# EAGLE design Esquemático (EAGLE 9.6.2)
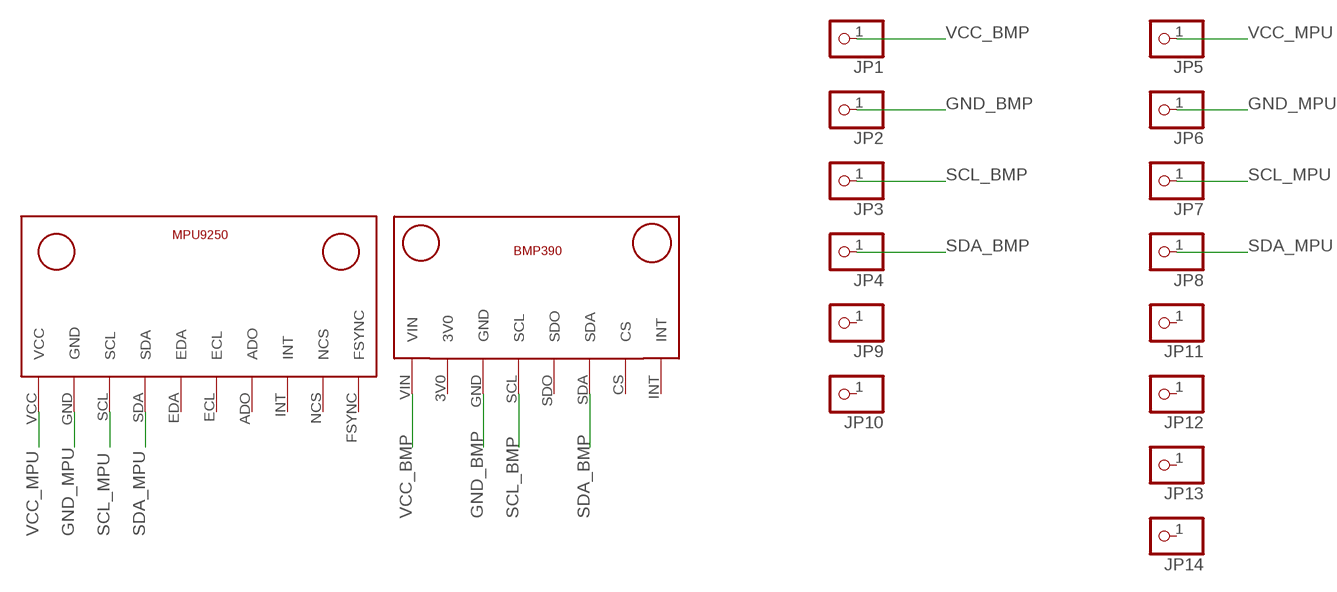
[diagram p0: schematic, sheet 1]

## Parts
JP1  PINHD-1X1  [1X01]
JP2  PINHD-1X1  [1X01]
JP3  PINHD-1X1  [1X01]
JP4  PINHD-1X1  [1X01]
JP5  PINHD-1X1  [1X01]
JP6  PINHD-1X1  [1X01]
JP7  PINHD-1X1  [1X01]
JP8  PINHD-1X1  [1X01]
JP9  PINHD-1X1  [1X01]
JP10  PINHD-1X1  [1X01]
JP11  PINHD-1X1  [1X01]
JP12  PINHD-1X1  [1X01]
JP13  PINHD-1X1  [1X01]
JP14  PINHD-1X1  [1X01]
U$3  BMP390V1  [BMP390_FOOTPRINT]
U$4  MPU9250V1  [MPU9250_FOOTPRINT]

## Nets
GND_BMP: JP2.1 U$3.GND
GND_MPU: JP6.1 U$4.GND
SCL_BMP: JP3.1 U$3.SCL
SCL_MPU: JP7.1 U$4.SCL
SDA_BMP: JP4.1 U$3.SDA
SDA_MPU: JP8.1 U$4.SDA
VCC_BMP: JP1.1 U$3.VIN
VCC_MPU: JP5.1 U$4.VCC
Unconnected: JP9.1 JP10.1 JP11.1 JP12.1 JP13.1 JP14.1 U$3.3V0 U$3.CS U$3.INT U$3.SDO U$4.ADO U$4.ECL U$4.EDA U$4.FSYNC U$4.INT U$4.NCS

## Library data of the parts
JP1-JP14 = pinhead:PINHD-1X1: PIN HEADER
U$3 = CRD:BMP390: Sensor barométrico
U$4 = CRD:MPU9250: Acelerômetro e Giroscópio

## Board
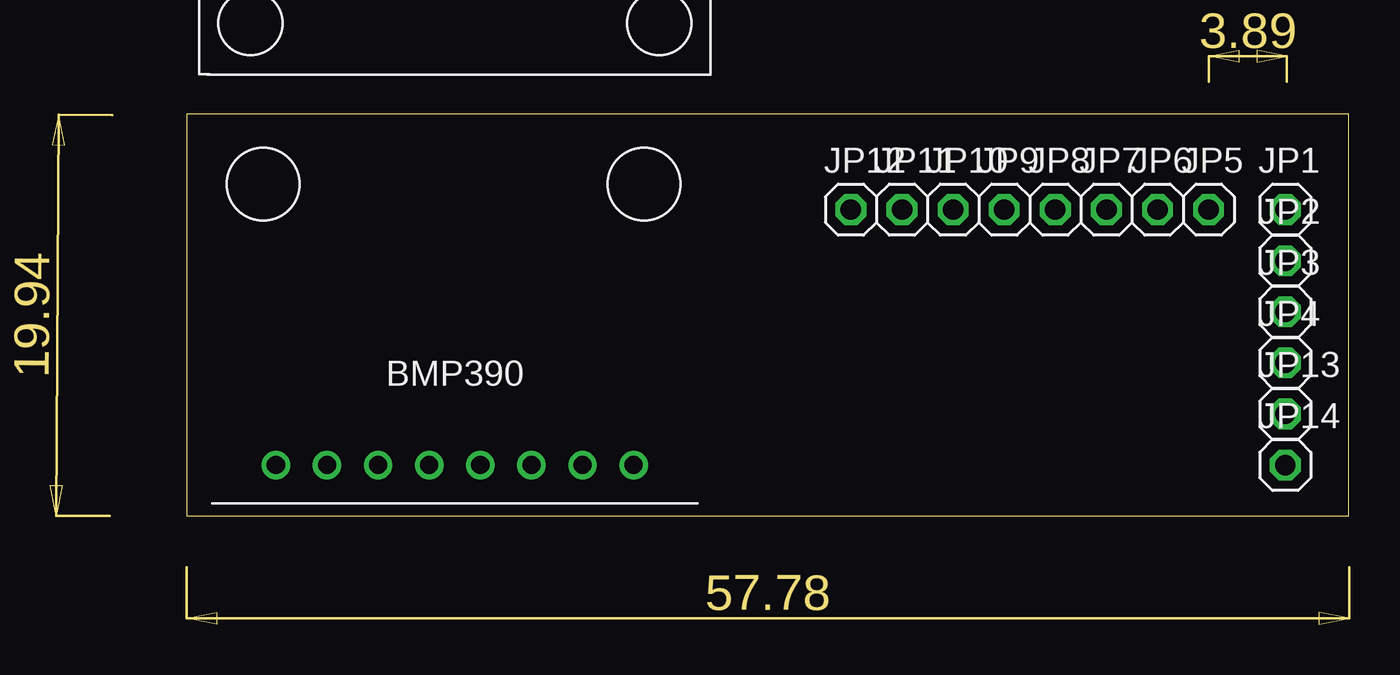
[diagram p1: board, top side]
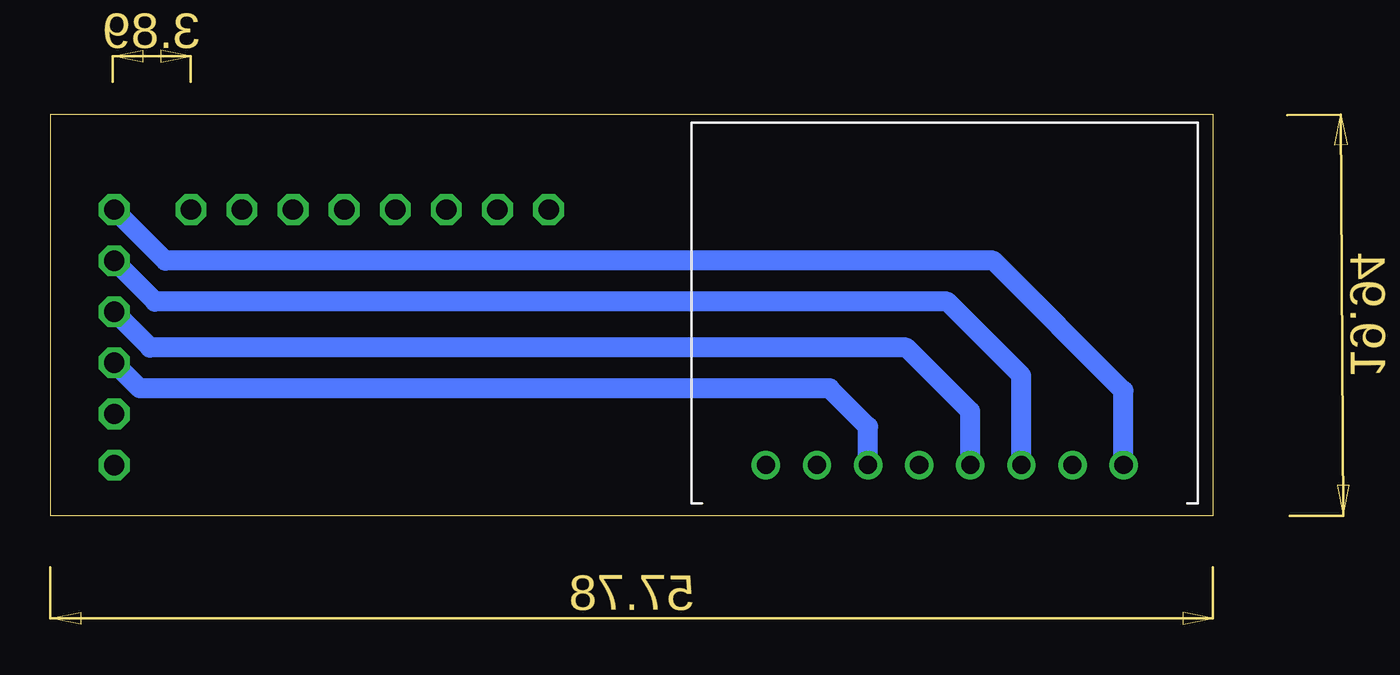
[diagram p2: board, bottom side, seen from below]

Size 57.77 x 19.99 mm. Coordinates in mm from the lower left corner, seen from the top.
Outline: 0,0 57.77,0 57.77,19.99 0,19.99 0,0
Copper layers (1*16): Top 0.035mm / dielectric 1.5mm / Bottom 0.035mm
Design rules "default *": minimum track width 1mm, minimum drill 0.35mm, track to track 10mil, track to pad 10mil, pad to pad 6mil, via to via 6mil, smd to smd 6mil, copper to edge 40mil, drill to drill 6mil, minimum pad ring 10mil, minimum via ring 8mil, stop-mask expansion 4mil, vias tented up to drill 0mil, thermal gap 10mil

### Footprints (pad centres in the part's own frame; a part is rotated, then mirrored left to right if it is on the bottom)
1X01 = drill 1.016 octagon: 1 0,0
BMP390_FOOTPRINT = drill 0.9: 3V0 -5.969,-8.382; CS 6.731,-8.382; GND -3.429,-8.382; INT 9.271,-8.382; SCL -0.889,-8.382; SDA 4.191,-8.382; SDO 1.651,-8.382; VIN -8.509,-8.382
MPU9250_FOOTPRINT = drill 0.9: ADO 3.81,-6.35; ECL 1.27,-6.35; EDA -1.27,-6.35; FSYNC 11.43,-6.35; GND -8.89,-6.35; INT 6.35,-6.35; NCS 8.89,-6.35; SCL -6.35,-6.35; SDA -3.81,-6.35; VCC -11.43,-6.35

### Placement (x,y rotation side)
JP1  54.61,15.24 0 top
JP2  54.61,12.7 0 top
JP3  54.61,10.16 0 top
JP4  54.61,7.62 0 top
JP5  50.8,15.24 0 top
JP6  48.26,15.24 0 top
JP7  45.72,15.24 0 top
JP8  43.18,15.24 0 top
JP9  40.64,15.24 0 top
JP10  38.1,15.24 0 top
JP11  35.56,15.24 0 top
JP12  33.02,15.24 0 top
JP13  54.61,5.08 0 top
JP14  54.61,2.54 0 top
U$3  12.95,10.92 0 top
U$4  13.34,29.34 180 top  (outside the outline)

### Tracks (layer width: path | path; a pad name or v marks a point on that pad's centre or on a via)
GND_BMP
  Bottom 1: U$3.GND 9.53,6.99 13.21,10.67 52.58,10.67 JP2.1
SCL_BMP
  Bottom 1: U$3.SCL 12.06,5.21 15.24,8.38 52.83,8.38 JP3.1
SDA_BMP
  Bottom 1: U$3.SDA 17.14,4.45 19.05,6.35 53.34,6.35 JP4.1
VCC_BMP
  Bottom 1: U$3.VIN 4.45,6.22 10.92,12.7 52.07,12.7 JP1.1